# EAGLE design SUSTAINA-StrainGauge-Sensing-Board (EAGLE 9.6.2)
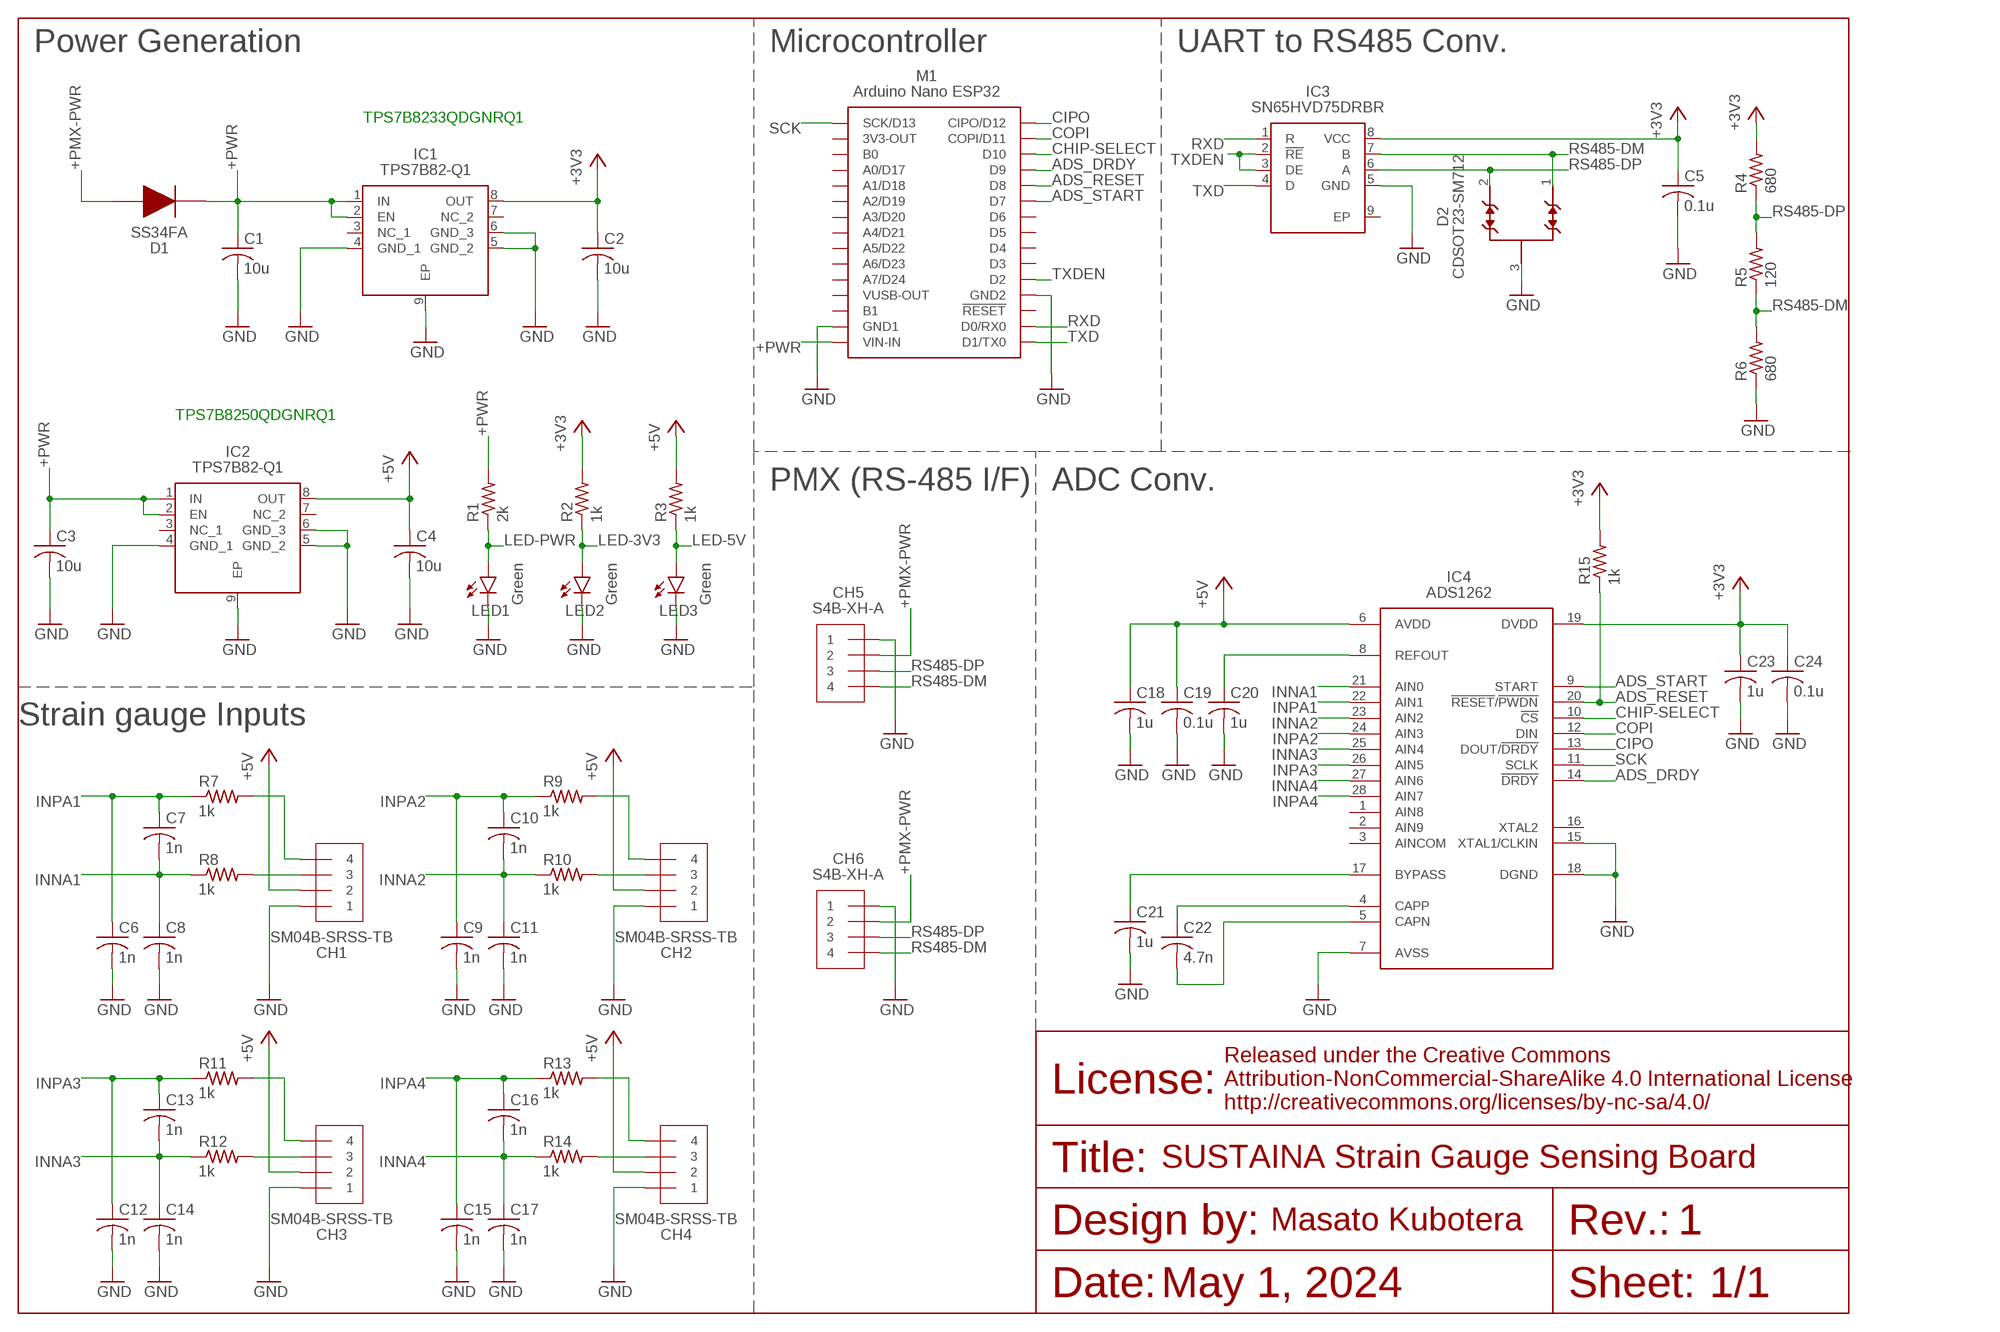
[diagram p0: schematic, sheet 1]

## Parts
C1  10u  C-USC0603  [C0603]
C2  10u  C-USC0603  [C0603]
C3  10u  C-USC0603  [C0603]
C4  10u  C-USC0603  [C0603]
C5  0.1u  C-USC0603  [C0603]
C6  1n  C-USC0603  [C0603]
C7  1n  C-USC0603  [C0603]
C8  1n  C-USC0603  [C0603]
C9  1n  C-USC0603  [C0603]
C10  1n  C-USC0603  [C0603]
C11  1n  C-USC0603  [C0603]
C12  1n  C-USC0603  [C0603]
C13  1n  C-USC0603  [C0603]
C14  1n  C-USC0603  [C0603]
C15  1n  C-USC0603  [C0603]
C16  1n  C-USC0603  [C0603]
C17  1n  C-USC0603  [C0603]
C18  1u  C-USC0603  [C0603]
C19  0.1u  C-USC0603  [C0603]
C20  1u  C-USC0603  [C0603]
C21  1u  C-USC0603  [C0603]
C22  4.7n  C-USC0603  [C0603]
C23  1u  C-USC0603  [C0603]
C24  0.1u  C-USC0603  [C0603]
CH1  SM04B-SRSS-TB  [SM04B-SRSS-TB]
CH2  SM04B-SRSS-TB  [SM04B-SRSS-TB]
CH3  SM04B-SRSS-TB  [SM04B-SRSS-TB]
CH4  SM04B-SRSS-TB  [SM04B-SRSS-TB]
CH5  S4B-XH-A  [S4B-XH-A]
CH6  S4B-XH-A  [S4B-XH-A]
D1  SS34FA  [SS34FA]
D2  CDSOT23-SM712  [SOT-23-3]
IC1  TPS7B82-Q1  [SOP65P490X110-9N]
IC2  TPS7B82-Q1  [SOP65P490X110-9N]
IC3  SN65HVD75DRBR  [SON65P300X300X100-9N]
IC4  ADS1262  [SOP65P640X120-28N]
LED1  Green  LEDSML0603  [SML0603]
LED2  Green  LEDSML0603  [SML0603]
LED3  Green  LEDSML0603  [SML0603]
M1  NANO-ESP32SMD  [NANO-ESP32-SMD]
R1  2k  R-US_R0603  [R0603]
R2  1k  R-US_R0603  [R0603]
R3  1k  R-US_R0603  [R0603]
R4  680  R-US_R0603  [R0603]
R5  120  R-US_R0603  [R0603]
R6  680  R-US_R0603  [R0603]
R7  1k  R-US_R0603  [R0603]
R8  1k  R-US_R0603  [R0603]
R9  1k  R-US_R0603  [R0603]
R10  1k  R-US_R0603  [R0603]
R11  1k  R-US_R0603  [R0603]
R12  1k  R-US_R0603  [R0603]
R13  1k  R-US_R0603  [R0603]
R14  1k  R-US_R0603  [R0603]
R15  1k  R-US_R0603  [R0603]

## Nets
+3V3 [power]: C2.1 C5.1 C23.1 C24.1 IC1.8(OUT) IC3.8(VCC) IC4.19(DVDD) R2.2 R4.2 R15.2
+5V [power]: C4.1 C18.1 C19.1 CH1.2 CH2.2 CH3.2 CH4.2 IC2.8(OUT) IC4.6(AVDD) R3.2
+PMX-PWR [high-power]: CH5.2 CH6.2 D1.2
+PWR [high-power]: C1.1 C3.1 D1.1 IC1.1(IN) IC1.2(EN) IC2.1(IN) IC2.2(EN) M1.VIN-IN R1.2
ADS_DRDY [signal]: IC4.14(!DRDY) M1.D9
ADS_RESET [signal]: IC4.20(!RESET!/!PWDN) M1.D8 R15.1
ADS_START [signal]: IC4.9(START) M1.D7
BYPASS [signal]: C21.1 IC4.17(BYPASS)
CAPN [signal]: C22.2 IC4.5(CAPN)
CAPP [signal]: C22.1 IC4.4(CAPP)
CHIP-SELECT [signal]: IC4.10(!CS) M1.D10
CIPO [signal]: IC4.13(DOUT/!DRDY) M1.CIPO/D12
COPI [signal]: IC4.12(DIN) M1.COPI/D11
GND [power]: C1.2 C2.2 C3.2 C4.2 C5.2 C6.2 C8.2 C9.2 C11.2 C12.2 C14.2 C15.2 C17.2 C18.2 C19.2 C20.2 C21.2 C23.2 C24.2 CH1.1 CH2.1 CH3.1 CH4.1 CH5.1 CH6.1 D2.3 IC1.4(GND_1) IC1.5(GND_2) IC1.6(GND_3) IC1.9(EP) IC2.4(GND_1) IC2.5(GND_2) IC2.6(GND_3) IC2.9(EP) IC3.5(GND) IC4.7(AVSS) IC4.15(XTAL1/CLKIN) IC4.18(DGND) LED1.C LED2.C LED3.C M1.GND1 M1.GND2 R6.1
INNA1 [signal]: C7.2 C8.1 IC4.21(AIN0) R8.1
INNA1_ [signal]: CH1.3 R8.2
INNA2 [signal]: C10.2 C11.1 IC4.23(AIN2) R10.1
INNA2_ [signal]: CH2.3 R10.2
INNA3 [signal]: C13.2 C14.1 IC4.25(AIN4) R12.1
INNA3_ [signal]: CH3.3 R12.2
INNA4: C16.2 C17.1 IC4.27(AIN6) R14.1
INNA4_ [signal]: CH4.3 R14.2
INPA1 [signal]: C6.1 C7.1 IC4.22(AIN1) R7.1
INPA1_ [signal]: CH1.4 R7.2
INPA2 [signal]: C9.1 C10.1 IC4.24(AIN3) R9.1
INPA2_ [signal]: CH2.4 R9.2
INPA3 [signal]: C12.1 C13.1 IC4.26(AIN5) R11.1
INPA3_ [signal]: CH3.4 R11.2
INPA4: C15.1 C16.1 IC4.28(AIN7) R13.1
INPA4_ [signal]: CH4.4 R13.2
LED-3V3 [low-power]: LED2.A R2.1
LED-5V [low-power]: LED3.A R3.1
LED-PWR [low-power]: LED1.A R1.1
REFOUT [signal]: C20.1 IC4.8(REFOUT)
RS485-DM [signal]: CH5.4 CH6.4 D2.1 IC3.7(B) R5.1 R6.2
RS485-DP [signal]: CH5.3 CH6.3 D2.2 IC3.6(A) R4.1 R5.2
RXD: IC3.1(R) M1.D0/RX0
SCK [signal]: IC4.11(SCLK) M1.SCK/D13
TXD: IC3.4(D) M1.D1/TX0
TXDEN: IC3.2(!RE) IC3.3(DE) M1.D2
Unconnected: IC1.3(NC_1) IC1.7(NC_2) IC2.3(NC_1) IC2.7(NC_2) IC3.9(EP) IC4.1(AIN8) IC4.2(AIN9) IC4.3(AINCOM) IC4.16(XTAL2) M1.3V3-OUT M1.!RESET M1.A0/D17 M1.A1/D18 M1.A2/D19 M1.A3/D20 M1.A4/D21 M1.A5/D22 M1.A6/D23 M1.A7/D24 M1.B0 M1.B1 M1.D3 M1.D4 M1.D5 M1.D6 M1.VUSB-OUT

## Notes on the sheet
- Power Generation | Microcontroller | UART to RS485 Conv.
- TPS7B8233QDGNRQ1
- TPS7B8250QDGNRQ1
- PMX (RS-485 I/F) | ADC Conv.
- Strain gauge Inputs
- SUSTAINA Strain Gauge Sensing Board
- 1
- May 1, 2024 | 1/1

## Library data of the parts
C1-C24 = rcl:C-US: CAPACITOR, American symbol; SPICEPREFIX: C
CH1-CH4 = SH-Connecters:SM04B-SRSS-TB
CH5 CH6 = JST-XH:S4B-XH-A
D1 = SS34FA:SS34FA
D2 = CDSOT23-SM712:CDSOT23-SM712
IC1 IC2 = TPS7B82-Q1:TPS7B82-Q1
IC3 = SN65HVD75DRBR:SN65HVD75DRBR
IC4 = ADS1262:ADS1262
LED1-LED3 = led:LED: LED OSRAM: - CHIPLED LG R971, LG N971, LY N971, LG Q971, LY Q971, LO R971, LY R971 LH N974, LH R974 LS Q976, LO Q976, LY Q976 LO Q996 - Hyper CHIPLED LW Q18S LB Q993, LB Q99A, LB R99A - SideLED LS A670, LO A670, LY A670, LG A670, LP A670 LB A673, LV A673, LT A673, LW A673 LH A674 LY A675 LS A676, LA A676, LO A676, LY A676, LW A676 LS A679, LY A679, LG A679 - Hyper Micro SIDELED® LS Y876, LA Y876, LO Y876, LY Y876 LT Y87S - SmartLED LW L88C, LW L88S LB L89C, LB L89S, LG L890 LS L89K, LO L89K, LY L89K LS L896, LA L896, LO L896, LY L896 - TOPLED LS T670, LO T670, LY T670, LG T670, LP T670 LSG T670, LSP T670, LSY T670, LOP T670, LYG T670 LG T671, LOG T671, LSG T671 LB T673, LV T673, LT T673, LW T673 LH T674 LS T676, LA T676, LO T676, LY T676, LB T676, LH T676, LSB T676, LW T676 LB T67C, LV T67C, LT T67C, LS T67K, LO T67K, LY T67K, LW E67C LS E67B, LA E67B, LO E67B, LY E67B, LB E67C, LV E67C, LT E67C LW T67C LS T679, LY T679, LG T679 LS T770, LO T770, LY T770, LG T770, LP T770 LB T773, LV T773, LT T773, LW T773 LH T774 LS E675, LA E675, LY E675, LS T675 LS T776, LA T776, LO T776, LY T776, LB T776 LHGB T686 LT T68C, LB T68C - Hyper Mini TOPLED® LB M676 - Mini TOPLED Santana® LG M470 LS M47K, LO M47K, LY M47K Source: http://www.osram.convergy.de LUXEON: - LUMILED® LXK2-PW12-R00, LXK2-PW12-S00, LXK2-PW14-U00, LXK2-PW14-V00 LXK2-PM12-R00, LXK2-PM12-S00, LXK2-PM14-U00 LXK2-PE12-Q00, LXK2-PE12-R00, LXK2-PE12-S00, LXK2-PE14-T00, LXK2-PE14-U00 LXK2-PB12-K00, LXK2-PB12-L00, LXK2-PB12-M00, LXK2-PB14-N00, LXK2-PB14-P00, LXK2-PB14-Q00 LXK2-PR12-L00, LXK2-PR12-M00, LXK2-PR14-Q00, LXK2-PR14-R00 LXK2-PD12-Q00, LXK2-PD12-R00, LXK2-PD12-S00 LXK2-PH12-R00, LXK2-PH12-S00 LXK2-PL12-P00, LXK2-PL12-Q00, LXK2-PL12-R00 Source: www.luxeon.com KINGBRIGHT: KA-3528ASYC Source: www.kingbright.com
M1 = Arduino:NANO-ESP32
R1-R15 = rcl:R-US_: RESISTOR, American symbol; SPICEPREFIX: R

## Net classes
0 default: width 0.203 mm
1 signal: width 0.203 mm, clearance 0.127 mm
2 power: width 0.381 mm
3 low-power: width 0.254 mm
4 high-power: width 0.508 mm

## Board
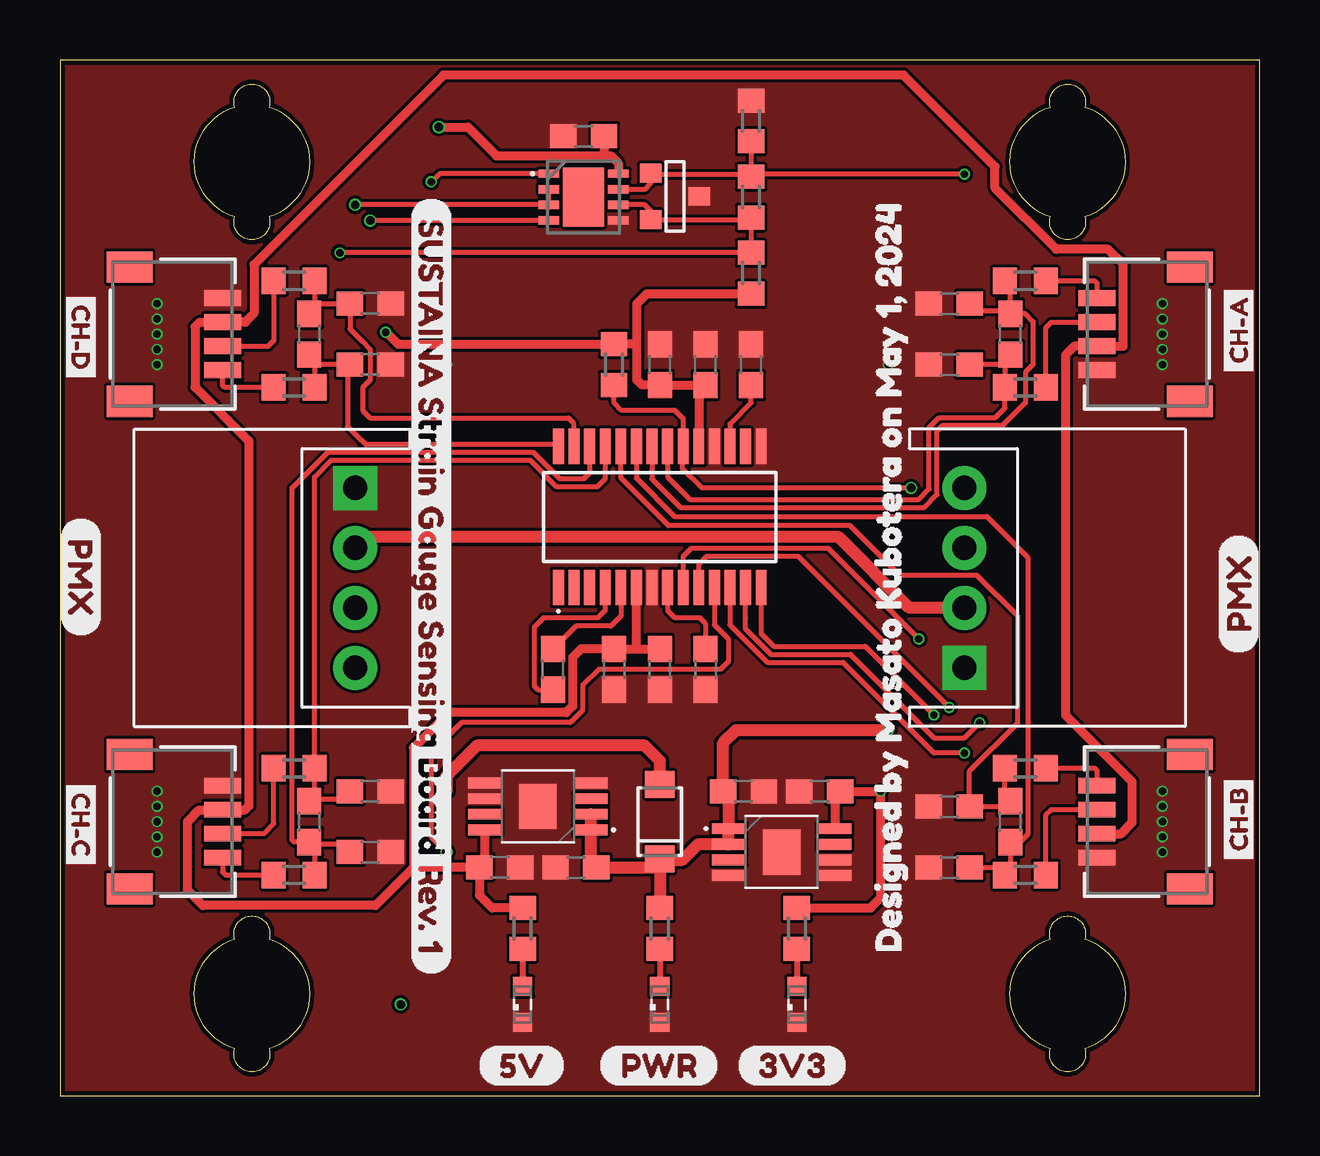
[diagram p1: board, top side]
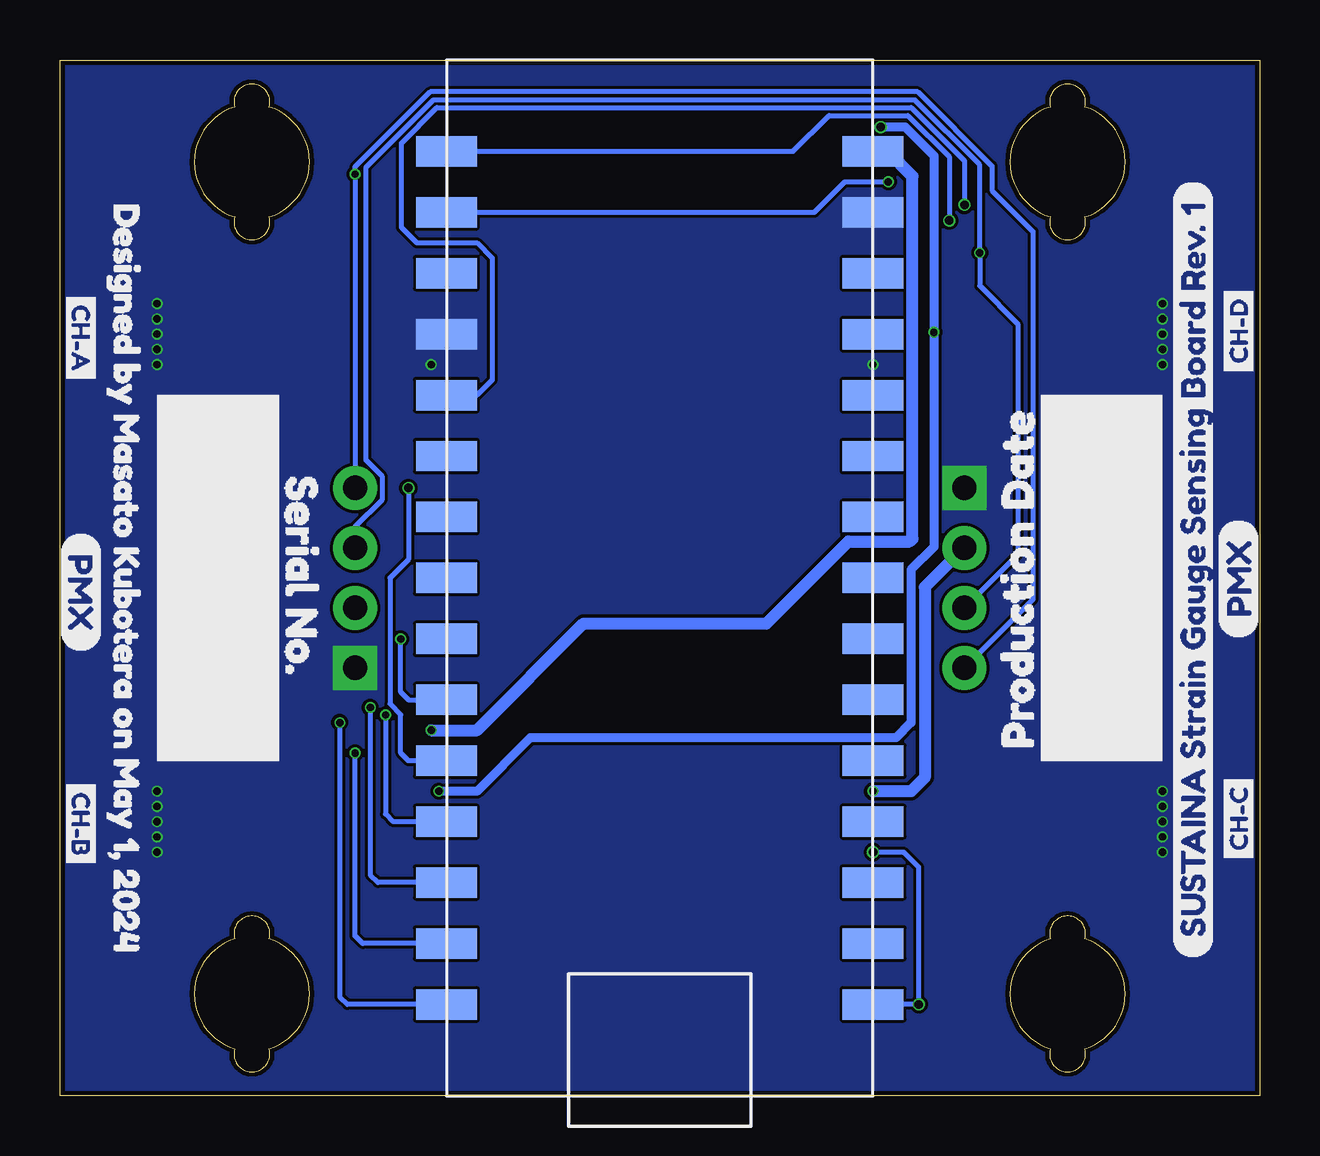
[diagram p2: board, bottom side, seen from below]

Size 50 x 43.18 mm. Coordinates in mm from the lower left corner, seen from the top.
Outline: 42.72,1.96 arc-213 41.28,1.96 arc-145 41.28,6.54 arc-213 42.72,6.54 arc-145 42.72,1.96
Outline: 41.28,41.22 arc-213 42.72,41.22 arc-145 42.72,36.64 arc-213 41.28,36.64 arc-145 41.28,41.22
Outline: 8.72,36.64 arc-213 7.28,36.64 arc-145 7.28,41.22 arc-213 8.72,41.22 arc-145 8.72,36.64
Outline: 7.28,6.54 arc-213 8.72,6.54 arc-145 8.72,1.96 arc-213 7.28,1.96 arc-145 7.28,6.54
Outline: 50,43.18 0,43.18 0,0 50,0 50,43.18
Copper layers (1*16): Top 0.035mm / dielectric 1.6mm / Bottom 0.035mm
Design rules "jlcpcb-2layers": minimum track width 5mil, minimum drill 0.3mm, track to track 5mil, track to pad 5mil, pad to pad 5mil, via to via 5mil, smd to smd 5mil, copper to edge 0.2mm, drill to drill 6mil, minimum pad ring 10mil, minimum via ring 3mil, stop-mask expansion 4mil, vias tented up to drill 0mil, thermal gap 10mil
vRestrict: area 16.1,0 to 33.9,43.2

### Footprints (pad centres in the part's own frame; a part is rotated, then mirrored left to right if it is on the bottom)
C0603 = smd 1.1 x 1: 1 -0.85,0; 2 0.85,0
SM04B-SRSS-TB = smd 0.66 x 1.549: 1 -1.5,4.638; 2 -0.5,4.638; 3 0.5,4.638; 4 1.5,4.638 | smd 1.295 x 1.905: 5 2.8,0.763; 6 -2.8,0.763
S4B-XH-A = drill 1.016 square: 1 3.75,0 | drill 1.016: 2 1.25,0; 3 -1.25,0; 4 -3.75,0
SS34FA = smd 1.12 x 1.22: 1 -1.55,0; 2 1.55,0
SOT-23-3 = smd 0.787 x 0.889: 1 0.991,1.016; 2 -0.94,1.016; 3 0.025,-1.016
SOP65P490X110-9N = smd 1.4 x 0.45: 1 -2.2,0.975; 2 -2.2,0.325; 3 -2.2,-0.325; 4 -2.2,-0.975; 5 2.2,-0.975; 6 2.2,-0.325; 7 2.2,0.325; 8 2.2,0.975 | smd 1.57 x 1.89: 9 0,0
SON65P300X300X100-9N = smd 0.85 x 0.35: 1 -1.45,0.975; 2 -1.45,0.325; 3 -1.45,-0.325; 4 -1.45,-0.975; 5 1.45,-0.975; 6 1.45,-0.325; 7 1.45,0.325; 8 1.45,0.975 | smd 1.7 x 2.45: 9 0,0
SOP65P640X120-28N = smd 1.475 x 0.45: 1 -2.938,4.225; 2 -2.938,3.575; 3 -2.938,2.925; 4 -2.938,2.275; 5 -2.938,1.625; 6 -2.938,0.975; 7 -2.938,0.325; 8 -2.938,-0.325; 9 -2.938,-0.975; 10 -2.938,-1.625; 11 -2.938,-2.275; 12 -2.938,-2.925; 13 -2.938,-3.575; 14 -2.938,-4.225; 15 2.938,-4.225; 16 2.938,-3.575; 17 2.938,-2.925; 18 2.938,-2.275; 19 2.938,-1.625; 20 2.938,-0.975; 21 2.938,-0.325; 22 2.938,0.325; 23 2.938,0.975; 24 2.938,1.625; 25 2.938,2.275; 26 2.938,2.925; 27 2.938,3.575; 28 2.938,4.225
SML0603 = smd 0.8 x 0.8: A 0.75,0; C -0.75,0
NANO-ESP32-SMD = smd 2.54 x 1.27: 3V3-OUT -8.89,15.24; !RESET 8.89,-12.7; A0/D17 -8.89,10.16; A1/D18 -8.89,7.62; A2/D19 -8.89,5.08; A3/D20 -8.89,2.54; A4/D21 -8.89,0; A5/D22 -8.89,-2.54; A6/D23 -8.89,-5.08; A7/D24 -8.89,-7.62; B0 -8.89,12.7; B1 -8.89,-12.7; CIPO/D12 8.89,17.78; COPI/D11 8.89,15.24; D0/RX0 8.89,-15.24; D1/TX0 8.89,-17.78; D2 8.89,-7.62; D3 8.89,-5.08; D4 8.89,-2.54; D5 8.89,0; D6 8.89,2.54; D7 8.89,5.08; D8 8.89,7.62; D9 8.89,10.16; D10 8.89,12.7; GND1 -8.89,-15.24; GND2 8.89,-10.16; SCK/D13 -8.89,17.78; VIN-IN -8.89,-17.78; VUSB-OUT -8.89,-10.16
R0603 = smd 1 x 1.1: 1 -0.85,0; 2 0.85,0

### Placement (x,y rotation side)
C1  28.49,12.7 0 top
C2  31.67,12.7 180 top
C3  21.51,9.53 180 top
C4  18.33,9.53 0 top
C5  21.82,40 180 top
C6  37.06,33.02 180 top
C7  39.61,31.75 270 top
C8  37.06,30.48 180 top
C9  37.06,12.06 180 top
C10  39.61,11.43 270 top
C11  37.06,9.53 180 top
C12  12.94,10.16 0 top
C13  10.39,11.43 90 top
C14  12.94,12.7 0 top
C15  12.94,30.48 0 top
C16  10.39,31.75 90 top
C17  12.94,33.02 0 top
C18  23.09,17.78 270 top
C19  25,17.78 270 top
C20  26.91,17.78 270 top
C21  28.81,30.48 90 top
C22  20.55,17.78 90 top
C23  26.91,30.48 90 top
C24  25,30.48 90 top
CH1  47.86,31.75 90 top
CH2  47.86,11.43 90 top
CH3  2.14,11.43 270 top
CH4  2.14,31.75 270 top
CH5  12.3,21.59 90 top
CH6  37.7,21.59 270 top
D1  25,11.43 90 top
D2  25.64,37.47 90 top
IC1  30.08,10.16 0 top
IC2  19.92,12.06 180 top
IC3  21.82,37.47 0 top
IC4  25,24.13 90 top
LED1  25,3.81 90 top
LED2  30.71,3.81 90 top
LED3  19.29,3.81 90 top
M1  25,21.59 180 bottom
R1  25,6.98 90 top
R2  30.71,6.98 90 top
R3  19.29,6.98 90 top
R4  28.81,34.29 270 top
R5  28.81,37.47 270 top
R6  28.81,40.64 270 top
R7  40.24,33.97 0 top
R8  40.24,29.53 0 top
R9  40.24,13.65 0 top
R10  40.24,9.21 0 top
R11  9.76,9.21 180 top
R12  9.76,13.65 180 top
R13  9.76,29.53 180 top
R14  9.76,33.97 180 top
R15  23.09,30.48 90 top
U$1  [PWR]  22.46,1.27 0 top
U$2  [3V3]  28.18,1.27 0 top
U$3  [CH#B0]  49.13,9.53 90 top
U$4  [CH#A0]  49.13,29.84 90 top
U$5  [CH#C0]  0.87,13.33 270 top
U$6  [CH#D0]  0.87,33.66 270 top
U$7  [PMX]  49.13,18.41 90 top
U$8  [PMX]  0.87,24.13 270 top
U$9  [5V]  17.38,1.27 0 top
U$10  [DESIGNED_BY_MASATO_KUBOTERA_ON_MAY_1]  34.52,5.08 90 top
U$11  [SUSTAINA_STRAIN_GAUGE_SENSING_BOARD_REV#_1]  15.47,37.47 270 top
U$12  [SUSTAINA_STRAIN_GAUGE_SENSING_BOARD_REV#_1]  2.77,5.71 90 bottom
U$13  [DESIGNED_BY_MASATO_KUBOTERA_ON_MAY_1]  47.23,38.1 270 bottom
U$14  [CH#C0]  0.87,9.53 90 bottom
U$15  [CH#D0]  0.87,29.84 90 bottom
U$16  [PMX]  0.87,19.05 90 bottom
U$17  [CH#B0]  49.13,13.33 270 bottom
U$18  [CH#A0]  49.13,33.66 270 bottom
U$19  [PMX]  49.13,23.5 270 bottom
U$20  SERIAL_NO#0  [SERIAL_NO#0]  39.92,26.99 270 bottom
U$21  PRODUCTION_DATE0  [PRODUCTION_DATE0]  10.08,13.33 90 bottom

### Tracks (layer width: path | path; a pad name or v marks a point on that pad's centre or on a via)
+3V3  (via drill 0.3, 0.35)
  Top 0.381: R2.2 33.79,7.83 34.21,8.25 v34.21,12.7 C2.1 32.3,12.7 32.3,11.11 IC1.8 | IC4.19 26.62,29.84 26.91,29.84 C23.1 C24.1 24.26,29.63 24.05,29.84 24.05,31.33 | R4.2 24.47,33.44 24.05,33.02 24.05,31.33 | C5.1 22.68,39.19 | 22.68,39.19 18.2,39.19 17,40.38 v15.79,40.38 | v13.57,31.83 13.6,31.83 14.1,31.33 R15.2 24.05,31.33 | 22.68,39.19 22.96,39.19 23.27,38.87 IC3.8
  Bottom 0.381: v34.21,12.7 32.62,12.7 30.4,14.92 15.16,14.92 14.52,15.56 14.52,21.93 13.57,22.88 v13.57,31.83 13.57,39.18 14.77,40.38 v15.79,40.38
+5V
  Top 0.381: CH2.2 44.23,10.93 44.69,11.38 44.69,13.1 41.91,15.88 41.91,30.88 42.28,31.25 CH1.2 44.31,31.25 44.31,34.66 43.69,35.29 41.52,35.29 38.97,37.84 38.97,38.73 35.16,42.55 15.98,42.55 8.09,34.65 8.09,32.62 7.72,32.25 CH4.2 5.83,32.25 5.63,32.06 5.63,29.54 7.87,27.3 7.87,12.08 7.7,11.91 6.75,11.91 | 24.02,18.63 C19.1 | 24.02,18.63 IC4.6 | 23.09,18.73 C18.1 | 17.72,9.53 C4.1 | C18.1 21.72,18.63 21.37,18.28 21.37,16.25 21.1,15.98 16.21,15.98 14.74,14.5 14.74,9.53 | R3.2 18.02,7.83 17.48,8.37 C4.1 | CH3.2 6.75,11.91 | 6.75,11.91 5.79,11.91 5.32,11.43 5.32,8.57 5.95,7.94 13.15,7.94 14.74,9.53 | C4.1 17.72,9.76 IC2.8 | C18.1 24.02,18.63 | C4.1 14.74,9.53
+PMX-PWR  (via drill 0.3)
  Top 0.508: D1.2 25,13.97 24.36,14.61 17.38,14.61 16.11,13.33 v16.11,12.7 | CH6.2 35.41,20.34 32.46,23.29 12.75,23.29 CH5.2
  Bottom 0.508: v16.11,12.7 14.52,12.7 13.95,13.27 13.95,21.21 12.3,22.86 CH5.2
+PWR  (via drill 0.3)
  Top 0.508: 27.86,10.48 27.86,11.11 | 27.86,11.11 27.86,12.48 C1.1 27.64,14.71 28.18,15.24 v34.52,15.24 | 27.86,11.11 IC1.1 | 25,9.53 R1.2 | IC2.2 22.12,11.11 22.14,11.11 IC2.1 22.12,9.53 C3.1 25,9.53 | 25,9.53 25,9.84 | 25,9.84 25.95,9.84 26.59,10.48 27.86,10.48 | 25,9.84 D1.1 | 27.86,10.48 IC1.2
  Bottom 0.508: v34.52,15.24 32.62,15.24 28.18,19.68 20.55,19.68 17.13,23.11 14.58,23.11 14.46,23.23 14.46,38.33 15.5,39.37 M1.VIN-IN
ADS_DRDY  (via drill 0.3)
  Top 0.203: v36.43,15.88 33.57,18.73 29.76,18.73 29.23,19.27 IC4.14
  Bottom 0.203: M1.D9 36.11,11.43 36.43,11.75 v36.43,15.88
ADS_RESET  (via drill 0.35)
  Top 0.203: R15.1 23.09,28.89 23.41,28.57 25.64,28.57 25.98,28.23 IC4.20 25.95,27.05 25.95,26.14 26.75,25.34 v35.48,25.34
  Bottom 0.203: M1.D8 35.48,13.97 35.8,14.29 35.8,15.88 36.25,16.34 36.25,21.59 35.48,22.36 v35.48,25.34
ADS_START  (via drill 0.3)
  Top 0.203: v35.8,19.05 32.04,22.81 26.29,22.81 25.98,22.49 IC4.9
  Bottom 0.203: v35.8,19.05 35.8,16.83 35.48,16.51 M1.D7
BYPASS
  Top 0.203: C21.1 28.81,28.89 27.93,28.01 IC4.17
CAPN
  Top 0.203: IC4.5 23.38,20 22.96,19.58 21.51,19.58 C22.2
CAPP
  Top 0.203: C22.1 19.92,16.93 19.76,17.09 19.76,19.53 20.16,19.92 22.41,19.92 22.73,20.24 IC4.4
CHIP-SELECT  (via drill 0.3)
  Top 0.203: IC4.10 26.62,22.16 26.94,22.48 30.78,22.48 v37.06,16.19
  Bottom 0.203: v37.06,16.19 37.06,9.21 36.75,8.89 M1.D10
CIPO  (via drill 0.3)
  Top 0.203: v38.34,15.56 37.7,14.92 36.43,14.92 32.95,18.4 29.63,18.4 28.57,19.45 28.57,19.92 | 28.57,19.92 IC4.13 | 28.57,19.92
  Bottom 0.203: M1.CIPO/D12 38.02,3.81 38.34,4.13 v38.34,15.56
COPI  (via drill 0.3)
  Top 0.203: v37.7,14.29 36.43,14.29 32.64,18.07 29.49,18.07 27.93,19.64 IC4.12
  Bottom 0.203: v37.7,14.29 37.7,6.67 37.38,6.35 M1.COPI/D11
GND  (via drill 0.3)
  other vias: 4.05,33.02 4.05,32.38 4.05,31.75 4.05,31.12 4.05,30.48 45.95,12.7 45.95,12.06 45.95,11.43 45.95,10.79 45.95,10.16 4.05,12.7 4.05,12.06 4.05,11.43 4.05,10.79 4.05,10.16 45.95,33.02 45.95,32.38 45.95,31.75 45.95,31.12 45.95,30.48 34.52,30.48 16.11,30.48
  pour Top (no thermals): -1.67,45.72 -1.67,-2.54 51.67,-2.54 51.67,45.72
  pour Bottom (no thermals): -2.94,46.99 -2.94,-3.81 52.94,-3.81 52.94,46.99
INNA1
  Top 0.203: IC4.21 25.32,25.8 26.26,24.86 35.8,24.86 36.23,25.29 36.23,27.86 36.64,28.27 38.98,28.27 39.39,28.68 R8.1 39.39,30.69 C7.2 39.19,30.48 C8.1
INNA1_
  Top 0.203: R8.2 41.09,32.02 41.32,32.25 CH1.3
INNA2
  Top 0.203: 39.29,9.53 39.29,9.21 R10.1 | C11.1 39.29,9.53 | 39.29,9.53 39.61,9.53 C10.2 40.02,10.58 40.33,10.89 40.33,22.45 38.63,24.16 25.61,24.16 24.02,25.74 IC4.23
INNA2_
  Top 0.203: CH2.3 41.32,11.93 41.09,11.7 R10.2
INNA3
  Top 0.203: C14.1 11.98,12.7 11.66,12.38 10.61,12.38 10.61,12.49 | 10.39,12.38 C13.2 10.61,12.49 | 10.61,12.49 R12.1 10.61,25.8 11.29,26.48 19.61,26.48 20.7,25.39 22.39,25.39 22.73,25.72 IC4.25
INNA3_
  Top 0.203: R12.2 8.91,11.35 8.49,10.93 CH3.3
INNA4
  Top 0.203: 10.71,33.02 10.61,32.92 | 10.61,32.92 10.39,32.7 C16.2 10.81,33.02 C17.1 12.09,31.96 12.62,31.43 12.94,31.12 12.94,29.84 12.62,29.53 12.62,28.57 12.94,28.26 21.19,28.26 21.43,28.02 IC4.27 | R14.1 10.61,32.92
INNA4_
  Top 0.203: R14.2 8.91,31.48 8.68,31.25 CH4.3
INPA1
  Top 0.203: 39.61,32.7 38.34,32.7 38.02,33.02 C6.1 | 39.61,32.7 39.61,33.97 R7.1 | 39.61,32.7 C7.1 40.24,32.6 40.56,32.28 40.56,30.48 40.24,30.16 40.24,28.89 39.29,27.94 36.78,27.94 36.56,27.72 36.56,25.06 36.03,24.53 25.86,24.53 24.68,25.72 IC4.22
INPA1_
  Top 0.203: R7.2 43.13,33.97 43.22,33.88 CH1.4
INPA2
  Top 0.203: C10.1 39.61,12.06 39.39,12.06 | 39.39,12.06 R9.1 | 39.39,12.06 C9.1 37.91,13.54 39.92,15.55 39.92,20 38.23,21.7 35,21.7 32.93,23.77 25.36,23.77 23.38,25.75 IC4.24
INPA2_
  Top 0.203: R9.2 43.13,13.65 43.22,13.56 CH2.4
INPA3
  Top 0.203: 10.61,10.48 R11.1 | 10.61,10.48 10.39,10.48 C13.1 9.76,10.58 9.67,10.67 9.67,25.32 11.15,26.81 19.74,26.81 20.84,25.72 21.82,25.72 22.07,25.97 IC4.26 | 10.61,10.48 11.66,10.48 C12.1
INPA3_
  Top 0.203: CH3.4 6.78,9.33 6.9,9.21 R11.2
INPA4
  Top 0.203: R13.1 10.61,30.69 C16.1 10.39,30.8 10.71,30.48 C15.1 11.98,30.38 11.98,27.89 12.54,27.33 12.57,27.33 12.76,27.14 20.7,27.14 IC4.28
INPA4_
  Top 0.203: R13.2 6.87,29.53 6.78,29.62 CH4.4
LED-3V3
  Top 0.254: R2.1 LED2.A
LED-5V
  Top 0.254: R3.1 LED3.A
LED-PWR
  Top 0.254: R1.1 LED1.A
REFOUT
  Top 0.203: IC4.8 25.32,20.24 25.64,19.92 26.67,19.92 26.91,19.68 C20.1
RS485-DM  (via drill 0.3)
  Top 0.203: IC3.7 23.41,37.78 24.36,37.78 24.62,38.04 D2.1 | R6.2 28.81,38.42 | 24.68,38.42 D2.1 | v37.7,38.42 28.81,38.42 | 28.81,38.42 R5.1 | D2.1 24.66,38.42 28.81,38.42
  Bottom 0.203: CH5.4 9.44,20.7 9.44,36.03 11.15,37.74 11.15,38.76 14.25,41.85 34.57,41.85 37.7,38.72 v37.7,38.42 CH6.4
RS485-DP  (via drill 0.3)
  Top 0.203: IC3.6 23.41,37.15 24.36,37.15 24.68,36.83 D2.2 24.68,36.51 28.81,36.51 R5.2 | 28.81,36.83 R5.2 | R5.2 28.81,36.2 | v11.66,35.14 R4.1 R5.2
  Bottom 0.203: CH5.3 10.08,22.56 10.08,32.18 11.66,33.77 v11.66,35.14 11.66,38.81 14.38,41.52 34.43,41.52 37.24,38.71 37.24,26.48 37.23,26.48 36.56,25.81 36.56,24.87 37.7,23.72 CH6.3
RXD  (via drill 0.3)
  Top 0.203: IC3.1 15.81,38.44 v15.47,38.1
  Bottom 0.203: M1.D0/RX0 18.56,36.83 17.29,38.1 v15.47,38.1
SCK  (via drill 0.35)
  Top 0.203: 15.47,14.29 16.74,15.56 21.27,15.56 21.79,16.07 21.79,17.11 22.46,17.78 27.54,17.78 27.86,18.1 27.86,19.05 27.27,19.63 IC4.11 | 15.47,14.29 | 15.47,14.29 15.47,10.79 v16.11,10.16
  Bottom 0.203: M1.SCK/D13 v14.21,3.81 14.21,9.53 14.84,10.16 v16.11,10.16
TXD  (via drill 0.35)
  Top 0.203: IC3.4 v12.94,36.49
  Bottom 0.203: M1.D1/TX0 19.44,39.37 17.95,40.86 14.66,40.86 12.94,39.14 v12.94,36.49
TXDEN  (via drill 0.35)
  Top 0.203: IC3.3 | IC3.3 IC3.2 | IC3.3 v12.3,37.14
  Bottom 0.203: v12.3,37.14 12.3,38.97 14.52,41.19 34.3,41.19 35.77,39.72 35.77,36.2 35.13,35.56 32.62,35.56 31.98,34.92 31.98,29.84 32.62,29.21 M1.D2